# Altium project 005_cizgi_sensor.PrjPcb
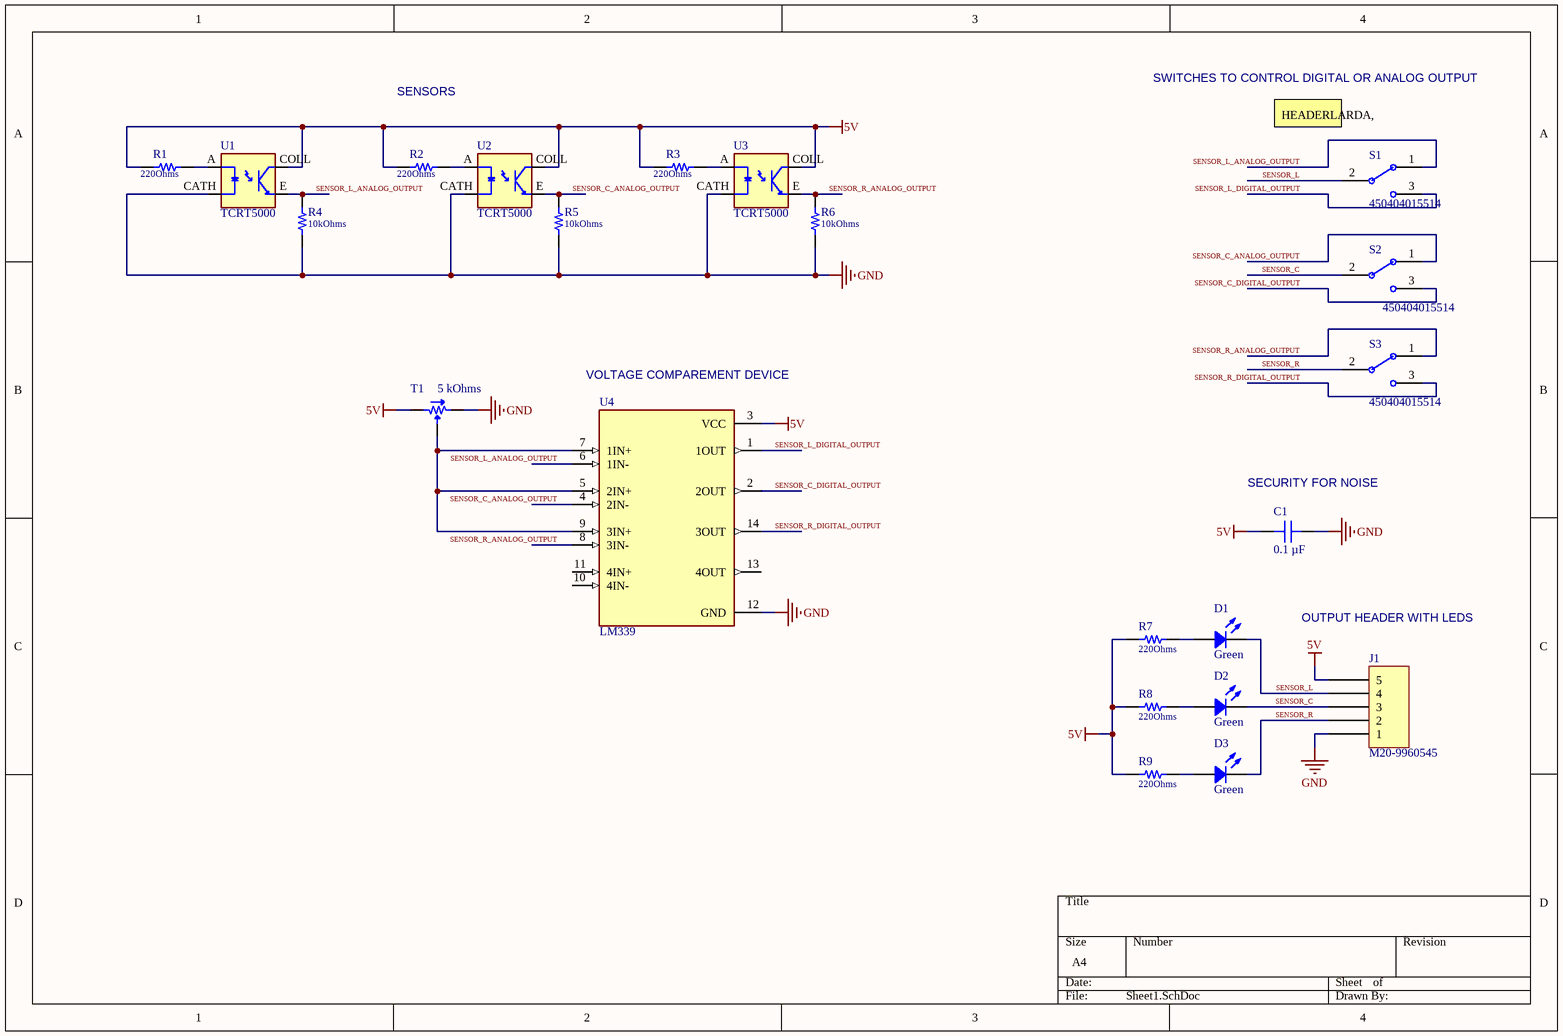
[diagram p0: Sheet1.SchDoc]
1 sheet, 22 parts. Net scope: global (net labels, ports and power ports of the same name join across sheets).
Board file: PCB1.PcbDoc

## Sheet Sheet1.SchDoc
size A4; SheetNumber: 1; SheetTotal: 1

### Parts
C1  0.1 µF  [CAP 0805_2012]
D1  Green  [LED 0805_2012 GREEN]
D2  Green  [LED 0805_2012 GREEN]
D3  Green  [LED 0805_2012 GREEN]
J1  M20-9960545  [HARWIN M20-9960545]
R1  220Ohms  [RES 0805_2012]
R2  220Ohms  [RES 0805_2012]
R3  220Ohms  [RES 0805_2012]
R4  10kOhms  [RES 0805_2012]
R5  10kOhms  [RES 0805_2012]
R6  10kOhms  [RES 0805_2012]
R7  220Ohms  [RES 0805_2012]
R8  220Ohms  [RES 0805_2012]
R9  220Ohms  [RES 0805_2012]
S1  450404015514  [WURTH WS-SLSU 450404015514]
S2  450404015514  [WURTH WS-SLSU 450404015514]
S3  450404015514  [WURTH WS-SLSU 450404015514]
T1  5 kOhms  [POT BOURNS TRIMPOT TC33]
U1  TCRT5000  [OPTO_TCRT5000]
U2  TCRT5000  [OPTO_TCRT5000]
U3  TCRT5000  [OPTO_TCRT5000]
U4  LM339  [SOIC127P600X175-14N]

### Nets
5V: C1.2 J1.5 R1.1 R2.1 R3.1 R7.2 R8.2 R9.2 T1.1 U1.COLL U2.COLL U3.COLL U4.3(VCC)
GND: C1.1 J1.1 R4.2 R5.2 R6.2 T1.3 U1.CATH U2.CATH U3.CATH U4.12(GND)
SENSOR_C: D2.2 J1.3 S2.2(COM)
SENSOR_C_ANALOG_OUTPUT: R5.1 S2.1 U2.E U4.4(2IN-)
SENSOR_C_DIGITAL_OUTPUT: S2.3 U4.2(2OUT)
SENSOR_L: D1.2 J1.4 S1.2(COM)
SENSOR_L_ANALOG_OUTPUT: R4.1 S1.1 U1.E U4.6(1IN-)
SENSOR_L_DIGITAL_OUTPUT: S1.3 U4.1(1OUT)
SENSOR_R: D3.2 J1.2 S3.2(COM)
SENSOR_R_ANALOG_OUTPUT: R6.1 S3.1 U3.E U4.8(3IN-)
SENSOR_R_DIGITAL_OUTPUT: S3.3 U4.14(3OUT)
NetD1_1: D1.1 R7.1
NetD2_1: D2.1 R8.1
NetD3_1: D3.1 R9.1
NetR1_2: R1.2 U1.A
NetR2_2: R2.2 U2.A
NetR3_2: R3.2 U3.A
NetT1_2: T1.2 U4.5(2IN+) U4.7(1IN+) U4.9(3IN+)

Not connected (* = marked no-connect by the designer): U4 10(4IN-) 11(4IN+) 13(4OUT)

### Notes on the sheet
- SENSORS
- SWITCHES TO CONTROL DIGITAL OR ANALOG OUTPUT
- (near S1) HEADERLARDA, eger 1 ve 2 inci pinleri birbirine jumper atarsan cıkıstan analog deger alırsın, eger 2 ve 3 üncü pinlerine jumper atarsan digital cıkıs alırısn logic 0 veya 1
- (near U4) VOLTAGE COMPAREMENT DEVICE
- (near C1) SECURITY FOR NOISE
- OUTPUT HEADER WITH LEDS

### Library data of the parts
C1 = CC0805JRX7R9BB104: CAP CER 0.1UF 50V X7R 0805; manufacturer: Yageo; Tolerance: ±5%; Part Number: CC0805JRX7R9BB104; Value: 0.1 µF; Applications: General Purpose; Capacitance: 0.1 µF; componentlink1description: Datasheet; componentlink1url: https://www.yageo.com/upload/media/product/productsearch/datasheet/mlcc/UPY-GPHC_X7R_6.3V-to-50V_18.pdf; componentlink2description: DigiKey Link; componentlink2url: https://www.digikey.com/en/products/detail/yageo/CC0805JRX7R9BB104/5195265; Device Package: 0805 (2012 Metric); lastupdated: 9/19/2022 1:04:26 PM; Lifecycle Status: Active; Minimum Order: 1; Mounting Type: Surface Mount, MLCC; Operating Temperature: -55°C ~ 125°C; Package / Case: 0805 (2012 Metric); packaging: TapeAndReel; partid: 42886; Part Status: Active; price: 0.02; series: CC; Size / Dimension: 0.079" L x 0.049" W (2.00mm x 1.25mm); Supplier 1: DigiKey; Supplier Part Number 1: 311-1858-1-ND; Temperature Coefficient: X7R; Thickness (Max): 0.037" (0.95mm); Voltage - Rated: 50V
D1-D3 = XZVG54W-4: 2.0X1.2MM GREEN SMD 0805 LED; Manufacturer: SunLED; Current - Test: 20mA; Lens Color: Colorless; Lens Size: 1.30mm x 1.25mm; Lens Style: Rectangle with Flat Top; Lens Transparency: Clear; Millicandela Rating: 49mcd; Viewing Angle: 140°; Voltage - Forward (Vf) (Typ): 2.1V; Wavelength - Dominant: 570nm; Wavelength - Peak: 574nm; Part Number: XZVG54W-4; Color: Green; ComponentLink1Description: Datasheet; ComponentLink1URL: https://www.sunledusa.com/products/spec/XZVG54W-4.pdf; ComponentLink2Description: DigiKey Link; ComponentLink2URL: https://www.digikey.com/en/products/detail/sunled/XZVG54W-4/13559316; Device Package: 0805 (2012 Metric); Height (Max): 0.50mm; LastUpdated: 9/19/2022 1:50:42 PM; Lifecycle Status: Active; Minimum Order: 1; Mounting Type: Surface Mount; Package / Case: 0805 (2012 Metric); Packaging: TapeAndReel; PartId: 1024; Part Status: Active; Price: 0.05; Series: -; Size / Dimension: 2.00mm L x 1.25mm W; Supplier 1: DigiKey; Supplier Part Number 1: 1497-XZVG54W-4CT-ND; Supplier Device Package: 0805; Value: Green
J1 = M20-9960545: CONN HEADER R/A 5POS 2.54MM; Manufacturer: Harwin Inc.; Connector Type: Header, Cuttable; Contact Length - Mating: 0.240" (6.10mm); Contact Length - Post: 0.118" (3.00mm); Current Rating (Amps): 3A per Contact; Material Flammability Rating: UL94 V-0; Number of Positions: 5; Number of Positions Loaded: All; Pitch - Mating: 0.100" (2.54mm); Row Spacing - Mating: -40°C ~ 105°C; Shrouding: Unshrouded; Style: Board to Board or Cable; Part Number: M20-9960545; ComponentLink1Description: Datasheet; ComponentLink1URL: https://cdn.harwin.com/pdfs/Harwin_PC_Connectors_M20.pdf; ComponentLink2Description: DigiKey Link; ComponentLink2URL: https://www.digikey.com/en/products/detail/harwin-inc/M20-9960545/3728210; Contact Finish - Mating: Gold; Contact Material: Brass; Contact Shape: Square; Contact Type: Male Pin; Fastening Type: Push-Pull; Insulation Color: Black; Insulation Height: 0.100" (2.54mm); Insulation Material: Polyamide (PA6T), Nylon 6T; LastUpdated: 9/21/2022 7:23:36 PM; Lifecycle Status: Active; Minimum Order: 1; Mounting Type: Through Hole, Right Angle; Number of Rows: 1; Operating Temperature: -40°C ~ 105°C; Packaging: Bulk; PartId: 168; Part Status: Active; Price: 0.14; Series: M20; Supplier 1: DigiKey; Supplier Part Number 1: 952-2246-ND; Termination: Solder
R1-R9 = ERJ-6ENF3001V: RES SMD 3K OHM 1% 1/8W 0805; Manufacturer: Panasonic Electronic Components; Power (Watts): 0.125W, 1/8W; Resistance: 3 kOhms; Temperature Coefficient: ±100ppm/°C; Part Number: ERJ-6ENF3001V; ComponentLink1Description: Datasheet; ComponentLink1URL: https://industrial.panasonic.com/cdbs/www-data/pdf/RDA0000/AOA0000C304.pdf; ComponentLink2Description: DigiKey Link; ComponentLink2URL: https://www.digikey.com/en/products/detail/panasonic-electronic-components/ERJ-6ENF3001V/366038; Composition: Thick Film; Device Package: 0805 (2012 Metric); Features: Automotive AEC-Q200; Height - Seated (Max): 0.028" (0.70mm); LastUpdated: 9/19/2022 1:36:50 PM; Lifecycle Status: Active; Minimum Order: 1; Number of Terminations: 2; Operating Temperature: -55°C ~ 155°C; Package / Case: 0805 (2012 Metric); Packaging: TapeAndReel; PartId: 30109; Part Status: Active; Price: 0.01; Ratings: AEC-Q200; Series: ERJ-6EN; Size / Dimension: 0.079" L x 0.049" W (2.00mm x 1.25mm); Supplier 1: DigiKey; Supplier Part Number 1: P3.0KCCT-ND; Supplier Device Package: 0805; Tolerance: ±1%
  R1-R3 R7-R9: Value: 220Ohms
  R4-R6: Value: 10kOhms
S1-S3 = 450404015514: MINI SLIDE SWITCH 6.7 X 2.7 MM.; Manufacturer: Würth Elektronik; Rated Current: 300mA; Rated Voltage: 5VDC; Switching Function: On-On; Circuit: SPDT; Actuator Length: 1.50mm; Actuator Type: Standard; Contact Timing: Non-Shorting (BBM); Current Rating (Amps): 300mA (DC); Voltage Rating - DC: 5 V; ComponentLink1Description: Datasheet; ComponentLink1URL: https://katalog.we-online.de/em/datasheet/450404015514.pdf; ComponentLink2Description: DigiKey Link; ComponentLink2URL: https://www.digikey.com/en/products/detail/würth-elektronik/450404015514/9950812; Packaging: TapeAndReel; Publisher: Wurth Elektronik; Contact Material: Copper Alloy; Mounting Technology: SMT; Operating Temperature: -40°C ~ 85°C; Contact Plating: Silver; Part Number: 450404015514; Published Date: September 2019; Terminal Material: Copper Alloy; Size: 6.7x2.7mm; Terminal Plating: Silver; Contact Finish: Silver; LastUpdated: 6/20/2022 1:21:56 PM; Lifecycle Status: Active; Minimum Order: 1; Mounting Type: Surface Mount; PartId: 5; Part Status: Active; Price: 0.48; Series: WS-SLSU; Supplier 1: DigiKey; Supplier Part Number 1: 732-13665-1-ND; Switch Function: On-On; Termination Style: SMD (SMT) Tab
T1 = TC33X-2-502E: TRIMMER 5K OHM 0.1W J LEAD TOP; Manufacturer: Bourns Inc.; Adjustment Type: Top Adjustment; Number of Turns: 1; Power (Watts): 0.1W, 1/10W; Resistive Material: Cermet; Temperature Coefficient: ±250ppm/°C; Tolerance: ±25%; Part Number: TC33X-2-502E; ComponentLink1Description: Datasheet; ComponentLink1URL: https://www.bourns.com/docs/Product-Datasheets/TC33.pdf; ComponentLink2Description: DigiKey Link; ComponentLink2URL: https://www.digikey.com/en/products/detail/bourns-inc/TC33X-2-502E/612861; LastUpdated: 9/19/2022 1:51:26 PM; Lifecycle Status: Active; Minimum Order: 1; Mounting Type: Surface Mount; Packaging: TapeAndReel; PartId: 6; Part Status: Active; Price: 0.11; Resistance: 5 kOhms; Series: Trimpot® TC33 - Open Frame; Size / Dimension: Rectangular - 0.150" x 0.142" Face (3.80mm x 3.60mm); Supplier 1: DigiKey; Supplier Part Number 1: TC33X-502ECT-ND; Termination Style: J Lead; Value: 5 kOhms
U1-U3 = TCRT5000: 950 nm 60 mA Through Hole Reflective Optical Sensor with Transistor Output; Value: *; Availability: Unavailable; Price: None; Package: None; MP: TCRT5000
U4 = LM339: Comparator Differential CMOS, MOS, Open-Collector, TTL 14-SOIC                                          LM339 is used in applications where a comparison between two voltage signals is required. In addition with four of those comparators on board the device can compare four pairs of voltage signals at a time which comes in handy in some applications.; MF: Texas Instruments; Package: SOIC-14 Texas Instruments; Value: *; Price: None; MP: LM339; Availability: Unavailable; SnapEDA_Link: https://www.snapeda.com/parts/LM339/Texas%20Instruments/view-part/2886154/?ref=snap